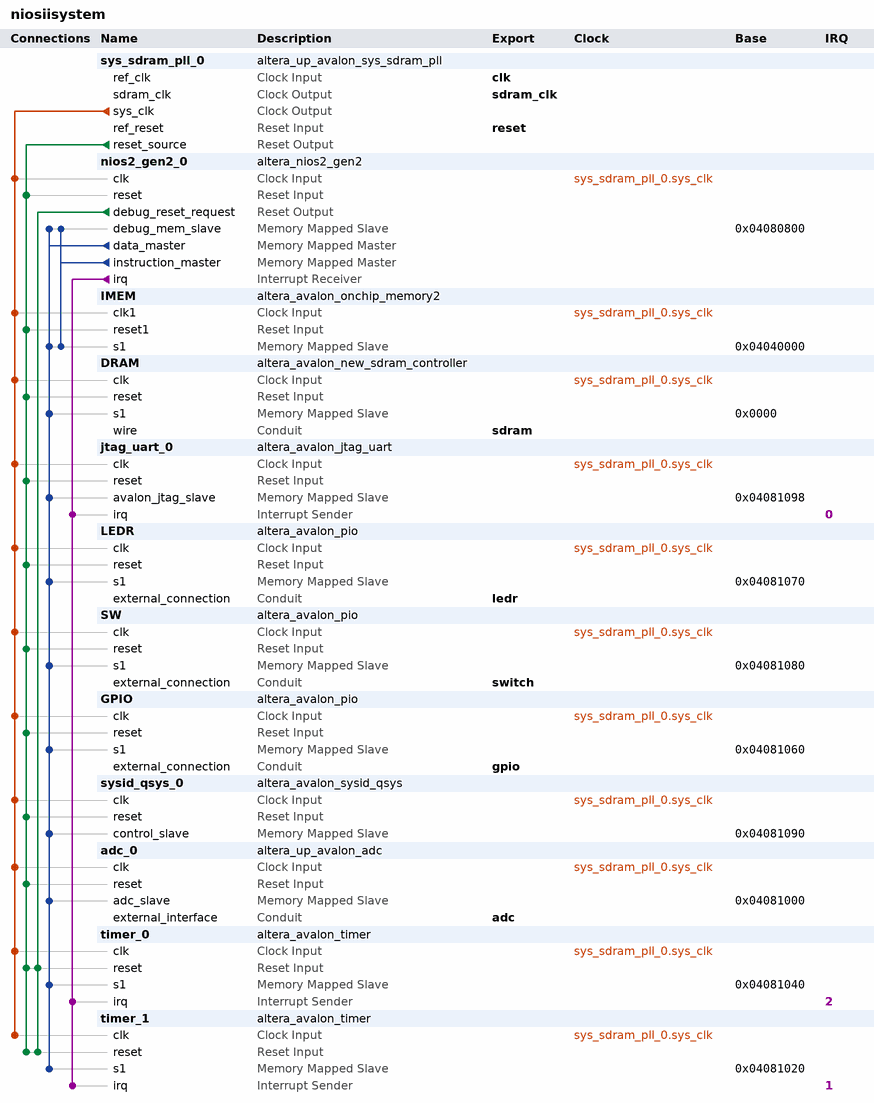
[diagram p0: system contents]
# Platform Designer (Qsys) system niosiisystem, Cyclone V 5CSXFC6D6F31C6
# Parameters at their usual value, and those the tool derives, are not listed.
package require -exact qsys 18.1
create_system niosiisystem
set_project_property DEVICE_FAMILY {Cyclone V}
set_project_property DEVICE 5CSXFC6D6F31C6

add_instance sys_sdram_pll_0 altera_up_avalon_sys_sdram_pll 18.0
set_instance_parameter_value sys_sdram_pll_0 CV_boards DE10-Standard
set_instance_parameter_value sys_sdram_pll_0 gui_outclk 50.0
set_instance_parameter_value sys_sdram_pll_0 gui_refclk 50.0

add_instance nios2_gen2_0 altera_nios2_gen2 18.1
set_instance_parameter_value nios2_gen2_0 dcache_size 2048
set_instance_parameter_value nios2_gen2_0 exceptionSlave IMEM.s1
set_instance_parameter_value nios2_gen2_0 icache_size 4096
set_instance_parameter_value nios2_gen2_0 impl Tiny
set_instance_parameter_value nios2_gen2_0 resetSlave IMEM.s1

add_instance IMEM altera_avalon_onchip_memory2 18.1
set_instance_parameter_value IMEM dataWidth 32
set_instance_parameter_value IMEM dualPort false
set_instance_parameter_value IMEM initMemContent true
set_instance_parameter_value IMEM initializationFileName onchip_mem.hex
set_instance_parameter_value IMEM memorySize 204800

add_instance DRAM altera_avalon_new_sdram_controller 18.1
set_instance_parameter_value DRAM TAC 5.5
set_instance_parameter_value DRAM TRCD 20.0
set_instance_parameter_value DRAM TRP 20.0
set_instance_parameter_value DRAM casLatency 3
set_instance_parameter_value DRAM columnWidth 10
set_instance_parameter_value DRAM dataWidth 16
set_instance_parameter_value DRAM generateSimulationModel false
set_instance_parameter_value DRAM model single_Micron_MT48LC4M32B2_7_chip
set_instance_parameter_value DRAM numberOfBanks 4
set_instance_parameter_value DRAM numberOfChipSelects 1
set_instance_parameter_value DRAM powerUpDelay 100.0
set_instance_parameter_value DRAM refreshPeriod 15.625
set_instance_parameter_value DRAM rowWidth 13

add_instance jtag_uart_0 altera_avalon_jtag_uart 18.1
set_instance_parameter_value jtag_uart_0 simInteractiveOptions NO_INTERACTIVE_WINDOWS

add_instance LEDR altera_avalon_pio 18.1
set_instance_parameter_value LEDR direction Output
set_instance_parameter_value LEDR width 10

add_instance SW altera_avalon_pio 18.1
set_instance_parameter_value SW direction Input
set_instance_parameter_value SW width 10

add_instance GPIO altera_avalon_pio 18.1
set_instance_parameter_value GPIO direction Output
set_instance_parameter_value GPIO width 16

add_instance sysid_qsys_0 altera_avalon_sysid_qsys 18.1
set_instance_parameter_value sysid_qsys_0 id 67637392

add_instance adc_0 altera_up_avalon_adc 18.0
set_instance_parameter_value adc_0 board DE10-Standard
set_instance_parameter_value adc_0 numch_ 8

add_instance timer_0 altera_avalon_timer 18.1
set_instance_parameter_value timer_0 period 1
set_instance_parameter_value timer_0 periodUnits MSEC

add_instance timer_1 altera_avalon_timer 18.1
set_instance_parameter_value timer_1 period 1
set_instance_parameter_value timer_1 periodUnits MSEC

# connections
add_connection sys_sdram_pll_0.sys_clk adc_0.clk clock
add_connection sys_sdram_pll_0.sys_clk DRAM.clk clock
add_connection sys_sdram_pll_0.sys_clk GPIO.clk clock
add_connection sys_sdram_pll_0.sys_clk IMEM.clk1 clock
add_connection sys_sdram_pll_0.sys_clk jtag_uart_0.clk clock
add_connection sys_sdram_pll_0.sys_clk LEDR.clk clock
add_connection sys_sdram_pll_0.sys_clk nios2_gen2_0.clk clock
add_connection sys_sdram_pll_0.sys_clk SW.clk clock
add_connection sys_sdram_pll_0.sys_clk sysid_qsys_0.clk clock
add_connection sys_sdram_pll_0.sys_clk timer_0.clk clock
add_connection sys_sdram_pll_0.sys_clk timer_1.clk clock
add_connection nios2_gen2_0.debug_reset_request timer_0.reset reset
add_connection nios2_gen2_0.debug_reset_request timer_1.reset reset
add_connection sys_sdram_pll_0.reset_source adc_0.reset reset
add_connection sys_sdram_pll_0.reset_source DRAM.reset reset
add_connection sys_sdram_pll_0.reset_source GPIO.reset reset
add_connection sys_sdram_pll_0.reset_source IMEM.reset1 reset
add_connection sys_sdram_pll_0.reset_source jtag_uart_0.reset reset
add_connection sys_sdram_pll_0.reset_source LEDR.reset reset
add_connection sys_sdram_pll_0.reset_source nios2_gen2_0.reset reset
add_connection sys_sdram_pll_0.reset_source SW.reset reset
add_connection sys_sdram_pll_0.reset_source sysid_qsys_0.reset reset
add_connection sys_sdram_pll_0.reset_source timer_0.reset reset
add_connection sys_sdram_pll_0.reset_source timer_1.reset reset
add_connection nios2_gen2_0.data_master adc_0.adc_slave avalon
set_connection_parameter_value nios2_gen2_0.data_master/adc_0.adc_slave baseAddress 0x04081000
add_connection nios2_gen2_0.data_master DRAM.s1 avalon
set_connection_parameter_value nios2_gen2_0.data_master/DRAM.s1 baseAddress 0x0000
add_connection nios2_gen2_0.data_master GPIO.s1 avalon
set_connection_parameter_value nios2_gen2_0.data_master/GPIO.s1 baseAddress 0x04081060
add_connection nios2_gen2_0.data_master IMEM.s1 avalon
set_connection_parameter_value nios2_gen2_0.data_master/IMEM.s1 baseAddress 0x04040000
add_connection nios2_gen2_0.data_master jtag_uart_0.avalon_jtag_slave avalon
set_connection_parameter_value nios2_gen2_0.data_master/jtag_uart_0.avalon_jtag_slave baseAddress 0x04081098
add_connection nios2_gen2_0.data_master LEDR.s1 avalon
set_connection_parameter_value nios2_gen2_0.data_master/LEDR.s1 baseAddress 0x04081070
add_connection nios2_gen2_0.data_master nios2_gen2_0.debug_mem_slave avalon
set_connection_parameter_value nios2_gen2_0.data_master/nios2_gen2_0.debug_mem_slave baseAddress 0x04080800
add_connection nios2_gen2_0.data_master SW.s1 avalon
set_connection_parameter_value nios2_gen2_0.data_master/SW.s1 baseAddress 0x04081080
add_connection nios2_gen2_0.data_master sysid_qsys_0.control_slave avalon
set_connection_parameter_value nios2_gen2_0.data_master/sysid_qsys_0.control_slave baseAddress 0x04081090
add_connection nios2_gen2_0.data_master timer_0.s1 avalon
set_connection_parameter_value nios2_gen2_0.data_master/timer_0.s1 baseAddress 0x04081040
add_connection nios2_gen2_0.data_master timer_1.s1 avalon
set_connection_parameter_value nios2_gen2_0.data_master/timer_1.s1 baseAddress 0x04081020
add_connection nios2_gen2_0.instruction_master IMEM.s1 avalon
set_connection_parameter_value nios2_gen2_0.instruction_master/IMEM.s1 baseAddress 0x04040000
add_connection nios2_gen2_0.instruction_master nios2_gen2_0.debug_mem_slave avalon
set_connection_parameter_value nios2_gen2_0.instruction_master/nios2_gen2_0.debug_mem_slave baseAddress 0x04080800
add_connection nios2_gen2_0.irq jtag_uart_0.irq interrupt
set_connection_parameter_value nios2_gen2_0.irq/jtag_uart_0.irq irqNumber 0
add_connection nios2_gen2_0.irq timer_0.irq interrupt
set_connection_parameter_value nios2_gen2_0.irq/timer_0.irq irqNumber 2
add_connection nios2_gen2_0.irq timer_1.irq interrupt
set_connection_parameter_value nios2_gen2_0.irq/timer_1.irq irqNumber 1

# exported interfaces
add_interface adc conduit end
set_interface_property adc EXPORT_OF adc_0.external_interface
add_interface clk clock sink
set_interface_property clk EXPORT_OF sys_sdram_pll_0.ref_clk
add_interface gpio conduit end
set_interface_property gpio EXPORT_OF GPIO.external_connection
add_interface ledr conduit end
set_interface_property ledr EXPORT_OF LEDR.external_connection
add_interface reset reset sink
set_interface_property reset EXPORT_OF sys_sdram_pll_0.ref_reset
add_interface sdram conduit end
set_interface_property sdram EXPORT_OF DRAM.wire
add_interface sdram_clk clock source
set_interface_property sdram_clk EXPORT_OF sys_sdram_pll_0.sdram_clk
add_interface switch conduit end
set_interface_property switch EXPORT_OF SW.external_connection

set_interconnect_requirement {$system} qsys_mm.clockCrossingAdapter HANDSHAKE
set_interconnect_requirement {$system} qsys_mm.enableEccProtection FALSE
set_interconnect_requirement {$system} qsys_mm.insertDefaultSlave FALSE
set_interconnect_requirement {$system} qsys_mm.maxAdditionalLatency 1

save_system niosiisystem.qsys
